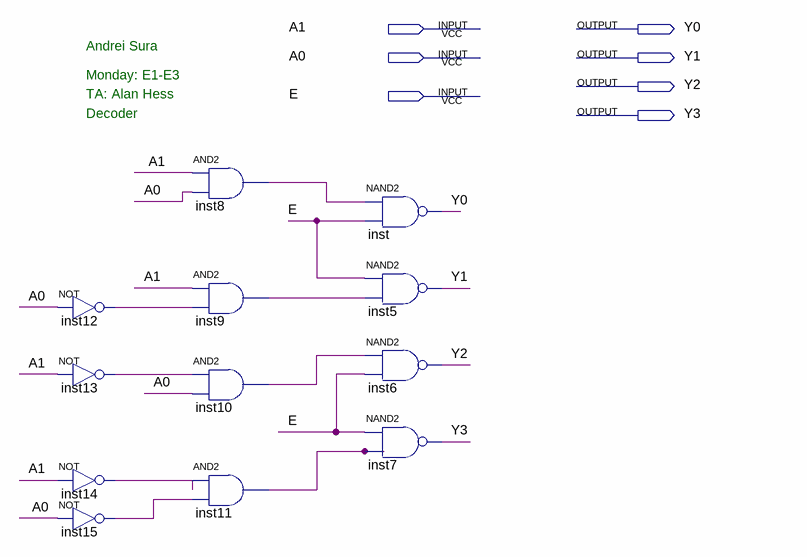
[diagram p0: schematic sheet]
// Quartus schematic lab_3_decoder.bdf as structural Verilog: 12 symbols, 7 pins
module lab_3_decoder (
  input  A1,
  input  A0,
  input  E,
  output Y0,
  output Y1,
  output Y2,
  output Y3
);

  wire inst8_out, inst9_out, inst10_out, inst11_out, inst12_out, inst13_out, inst14_out, inst15_out;

  not inst12 (inst12_out, A0);
  not inst13 (inst13_out, A1);
  not inst14 (inst14_out, A1);
  not inst15 (inst15_out, A0);
  and inst8 (inst8_out, A1, A0);
  and inst9 (inst9_out, A1, inst12_out);
  and inst10 (inst10_out, inst13_out, A0);
  and inst11 (inst11_out, inst14_out, inst15_out);
  nand inst (Y0, inst8_out, E);
  nand inst5 (Y1, E, inst9_out);
  nand inst6 (Y2, inst10_out, E);
  nand inst7 (Y3, E, inst11_out);

  // Notes on the sheet:
  //   Andrei Sura
  //   Monday: E1-E3
  //   TA: Alan Hess
  //   Decoder
endmodule
